# Altium project PCB_Project.PrjPcb
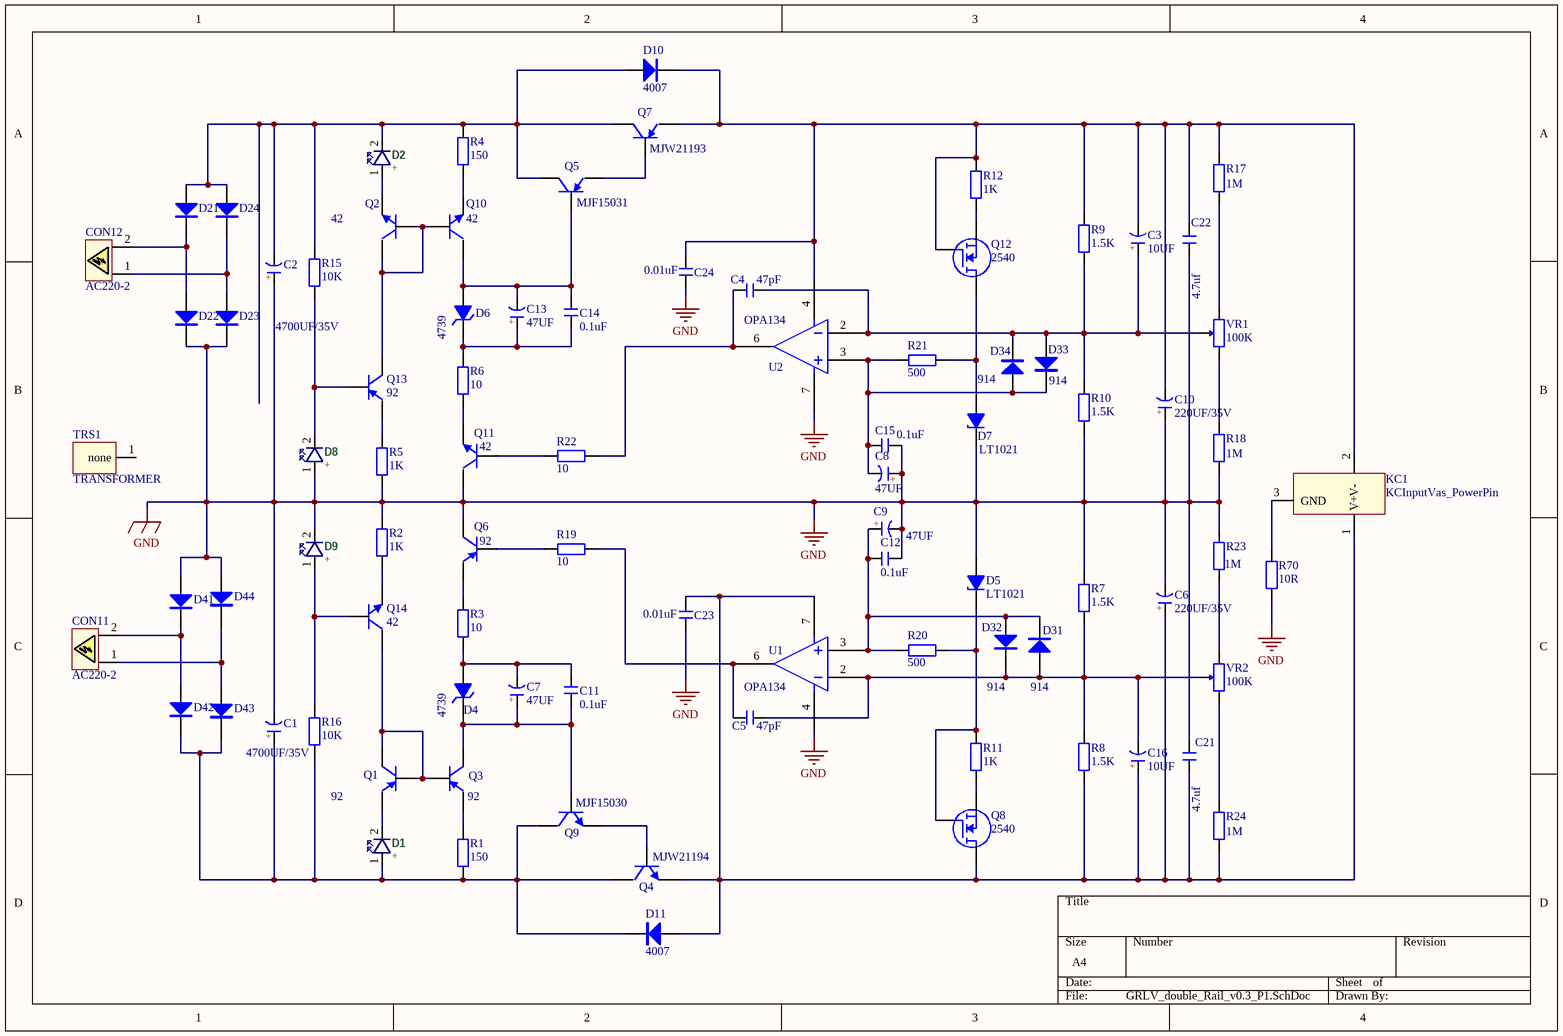
[diagram p0: GRLV_double_Rail_v0.3_P1.SchDoc]
2 sheets, 173 parts. Net scope: global (net labels, ports and power ports of the same name join across sheets).
Board file: GRLV_double_Rail_v0.3.PcbDoc
Sheets:
  GRLV_double_Rail_v0.3_P1.SchDoc
  GRLV_double_Rail_v0.3_P2.SchDoc

## Sheet GRLV_double_Rail_v0.3_P1.SchDoc
size A4

### Parts
C1  4700UF/35V  [CAP 10*22*31.5 - BK]
C2  4700UF/35V  [CAP 10*22*31.5 - BK]
C3  10UF  [CAP 2.5*6.3*7]
C4  47pF  [CBB 6.3*6.3*5]
C5  47pF  [CBB 6.3*6.3*5]
C6  220UF/35V  [CAP 5.0*10*12.5]
C7  47UF  [CAP 3.5*8*11.5]
C8  47UF  [CAP 2.5*6.3*11.2]
C9  47UF  [CAP 2.5*6.3*11.2]
C10  220UF/35V  [CAP 5.0*10*12.5]
C11  0.1uF  [CBB 6.3*6.3*5]
C12  0.1uF  [CBB 6.3*6.3*5]
C13  47UF  [CAP 3.5*8*11.5]
C14  0.1uF  [CBB 6.3*6.3*5]
C15  0.1uF  [CBB 6.3*6.3*5]
C16  10UF  [CAP 2.5*6.3*7]
C21  4.7uf  [CBB 7.2*7.2*13]
C22  4.7uf  [CBB 7.2*7.2*13]
C23  value 0.01uF  [CBB 6.3*6.3*5]  (hidden comment: .01)
C24  value 0.01uF  [CBB 6.3*6.3*5]  (hidden comment: .01)
CON11  AC220-2  [HX4.0-2XS]
CON12  AC220-2  [HX4.0-2XS]
D1  +  [LED 3MM-R]
D2  +  [LED 3MM-R]
D4  4739  [DO-41]
D5  LT1021  [DIP8-300_MH]
D6  4739  [DO-41]
D7  LT1021  [DIP8-300_MH]
D8  +  [LED 3MM-R]
D9  +  [LED 3MM-R]
D10  4007  [DO-41]
D11  4007  [DO-41]
D21  VS-HFA08TB60-M3  [DO-15XL]  (value not drawn)
D22  VS-HFA08TB60-M3  [DO-15XL]  (value not drawn)
D23  VS-HFA08TB60-M3  [DO-15XL]  (value not drawn)
D24  VS-HFA08TB60-M3  [DO-15XL]  (value not drawn)
D31  914  [DO-35]
D32  914  [DO-35]
D33  914  [DO-35]
D34  914  [DO-35]
D41  VS-HFA08TB60-M3  [DO-15XL]  (value not drawn)
D42  VS-HFA08TB60-M3  [DO-15XL]  (value not drawn)
D43  VS-HFA08TB60-M3  [DO-15XL]  (value not drawn)
D44  VS-HFA08TB60-M3  [DO-15XL]  (value not drawn)
KC1  KCInputVas_PowerPin  [KCIn_VAS_PowerPin_M2.0]
Q1  92  [TO92A]
Q2  42  [TO92A]
Q3  92  [TO92A]
Q4  MJW21194  [TO247V]
Q5  MJF15031  [TO220V]
Q6  92  [TO92A]
Q7  MJW21193  [TO247V]
Q8  2540  [TO92A]
Q9  MJF15030  [TO220V]
Q10  42  [TO92A]
Q11  42  [TO92A]
Q12  2540  [TO92A]
Q13  92  [TO92A]
Q14  42  [TO92A]
R1  150  [RS 1/4W]
R2  1K  [RS 1/4W]
R3  10  [RS 1/4W]
R4  150  [RS 1/4W]
R5  1K  [RS 1/4W]
R6  10  [RS 1/4W]
R7  1.5K  [RS 1/4W]
R8  1.5K  [RS 1/4W]
R9  1.5K  [RS 1/4W]
R10  1.5K  [RS 1/4W]
R11  1K  [RS 1/4W]
R12  1K  [RS 1/4W]
R15  10K  [RS 1/4W]
R16  10K  [RS 1/4W]
R17  1M  [RS 1/4W]
R18  1M  [RS 1/4W]
R19  10  [RS 1/4W]
R20  500  [RS 1/4W]
R21  500  [RS 1/4W]
R22  10  [RS 1/4W]
R23  1M  [RS 1/4W]
R24  1M  [RS 1/4W]
R70  10R  [RS 1/2W]
TRS1  TRANSFORMER  [TRANS_BLOCK_m4_68mm]
U1  OPA134  [DIP8-300_MH]
U2  OPA134  [DIP8-300_MH]
VR1  100K  [RS 1/2W-VR]
VR2  100K  [RS 1/2W-VR]

### Nets
GND: C1.2(K) C2.1(A) C6.2(K) C8.1(A) C9.2(K) C10.1(A) C12.2 C15.2 C21.2 C22.1 C23.1 C24.1 D5.4(A) D7.6(K) D8.1(A) D9.2(K) D22.1(Cathode) D23.1(Cathode) D41.2(Anode) D44.2(Anode) Q6.3(C) Q11.3(C) R2.2 R5.1 R7.2 R10.1 R18.1 R23.2 R70.1 U1.4(V-) U2.7(V+)
NetC1_1: C1.1(A) D1.1(A) D11.2(K) D42.1(Cathode) D43.1(Cathode) Q4.2(C) Q9.2(C) R1.1 R16.1
NetC2_2: C2.2(K) D2.2(K) D10.1(A) D21.2(Anode) D24.2(Anode) Q5.2(C) Q7.2(C) R4.2 R15.2
NetC3_1: C3.1(A) C4.2 D33.1(A) D34.2(K) R9.1 R10.2 U2.2(-in) VR1.3
NetC3_2: C3.2(K) C10.2(K) C22.2 C24.2 D10.2(K) KC1.2(V-) Q7.3(E) Q12.2(G) R9.2 R12.2 R17.2 U2.4(V-)
NetC4_1: C4.1 R22.2 U2.6(out)
NetC5_1: C5.1 R19.2 U1.6(out)
NetC5_2: C5.2 C16.2(K) D31.1(A) D32.2(K) R7.1 R8.2 U1.2(-in) VR2.3
NetC6_1: C6.1(A) C16.1(A) C21.1 C23.2 D11.1(A) KC1.1(V+) Q4.3(E) Q8.3(D) R8.1 R24.1 U1.7(V+)
NetC7_1: C7.1(A) C11.1 D4.2(K) Q3.3(C) Q9.1(B)
NetC7_2: C7.2(K) C11.2 D4.1(A) R3.1
NetC8_2: C8.2(K) C15.1 D33.2(K) D34.1(A) R21.1 U2.3(+in)
NetC9_1: C9.1(A) C12.1 D31.2(K) D32.1(A) R20.1 U1.3(+in)
NetC13_1: C13.1(A) C14.1 D6.2(K) R6.2
NetC13_2: C13.2(K) C14.2 D6.1(A) Q5.1(B) Q10.3(C)
NetCON11_1: CON11.1(L) D43.2(Anode) D44.1(Cathode)
NetCON11_2: CON11.2(G) D41.1(Cathode) D42.2(Anode)
NetCON12_1: CON12.1(L) D23.2(Anode) D24.1(Cathode)
NetCON12_2: CON12.2(G) D21.1(Cathode) D22.2(Anode)
NetD1_2: D1.2(K) Q1.1(E)
NetD2_1: D2.1(A) Q2.1(E)
NetD5_6: D5.6(K) Q8.2(G) R11.2 R20.2
NetD7_4: D7.4(A) Q12.3(D) R21.2
NetD8_2: D8.2(K) Q13.2(B) R15.1
NetD9_1: D9.1(A) Q14.2(B) R16.2
NetKC1_3: KC1.3(GND) R70.2
NetQ1_2: Q1.2(B) Q1.3(C) Q3.2(B) Q14.3(C)
NetQ2_2: Q2.2(B) Q2.3(C) Q10.2(B) Q13.3(C)
NetQ3_1: Q3.1(E) R1.2
NetQ4_1: Q4.1(B) Q9.3(E)
NetQ5_3: Q5.3(E) Q7.1(B)
NetQ6_1: Q6.1(E) R3.2
NetQ6_2: Q6.2(B) R19.1
NetQ8_1: Q8.1(S) R11.1
NetQ10_1: Q10.1(E) R4.1
NetQ11_1: Q11.1(E) R6.1
NetQ11_2: Q11.2(B) R22.1
NetQ12_1: Q12.1(S) R12.1
NetQ13_1: Q13.1(E) R5.2
NetQ14_1: Q14.1(E) R2.1
NetR17_1: R17.1 VR1.2
NetR18_2: R18.2 VR1.1
NetR23_1: R23.1 VR2.2
NetR24_2: R24.2 VR2.1

Not connected (* = marked no-connect by the designer): TRS1 1(none)

### Notes on the sheet
- (in symbol C-CAP) +

### Library data of the parts
C1-C3 C6-C10 C13 C16 = C-CAP: 直插电解电容; 版权归属: 源创客; BOM名称: 直插电解电容; 学习资源: www.ooocke.com
C4 C5 C11 C12 C14 C15 C23 C24 = C-CBB: CBB电容; 版权归属: 源创客; BOM名称: CBB电容; 学习资源: www.ooocke.com
C21 C22 = C-MKS: MKS薄膜电容
D1 D2 D8 D9 = LED: 直插式LED
D4 D6 = 1N4739: 9.1V/1W稳压管
D5 D7 = LT1021-10-2P: 10V Precision Reference 2 Pin Config
D10 D11 = 1N4007: 整流二极管; 版权归属: 源创客; BOM名称: 整流二极管; 学习资源: www.ooocke.com
D21-D24 D41-D44 = VS-HFA08TB60-M3: Ultrafast Soft Recovery Diado 8A 600V; pin to pad: 1>2 2>1
D31-D34 = 1N914: 高速开关管 1V/0.25W
KC1 = KCInputVas_PowerPin: King Cello Input Stage and VAS
Q1 Q3 Q6 Q13 = KSP92/93: High Voltage PNP Transistor
Q2 Q10 Q11 Q14 = KSP42/43: High Voltage NPN Transistor
Q4 = MJW21194: Power NPN Transistor
Q5 = MJF15031: Power PNP Transistor
Q7 = MJW21193: Power PNP Transistor
Q8 Q12 = DN2540: N沟道耗尽型DMOS场效应管 400V/150ma
Q9 = MJF15030: Power NPN Transistor
R1-R12 R15-R24 R70 = R-CRR: 直插色环电阻; BOM名称: 色环电阻; 版权归属: 源创客; 学习资源: www.ooocke.com
  R4: Value: 150
  R9: Value: 1.5K
  R17 R18 R23 R24: Value: 1M
U1 U2 = OPA134PA
VR1 VR2 = VR-W: 直插可调电阻-顶调

## Sheet GRLV_double_Rail_v0.3_P2.SchDoc
size A4
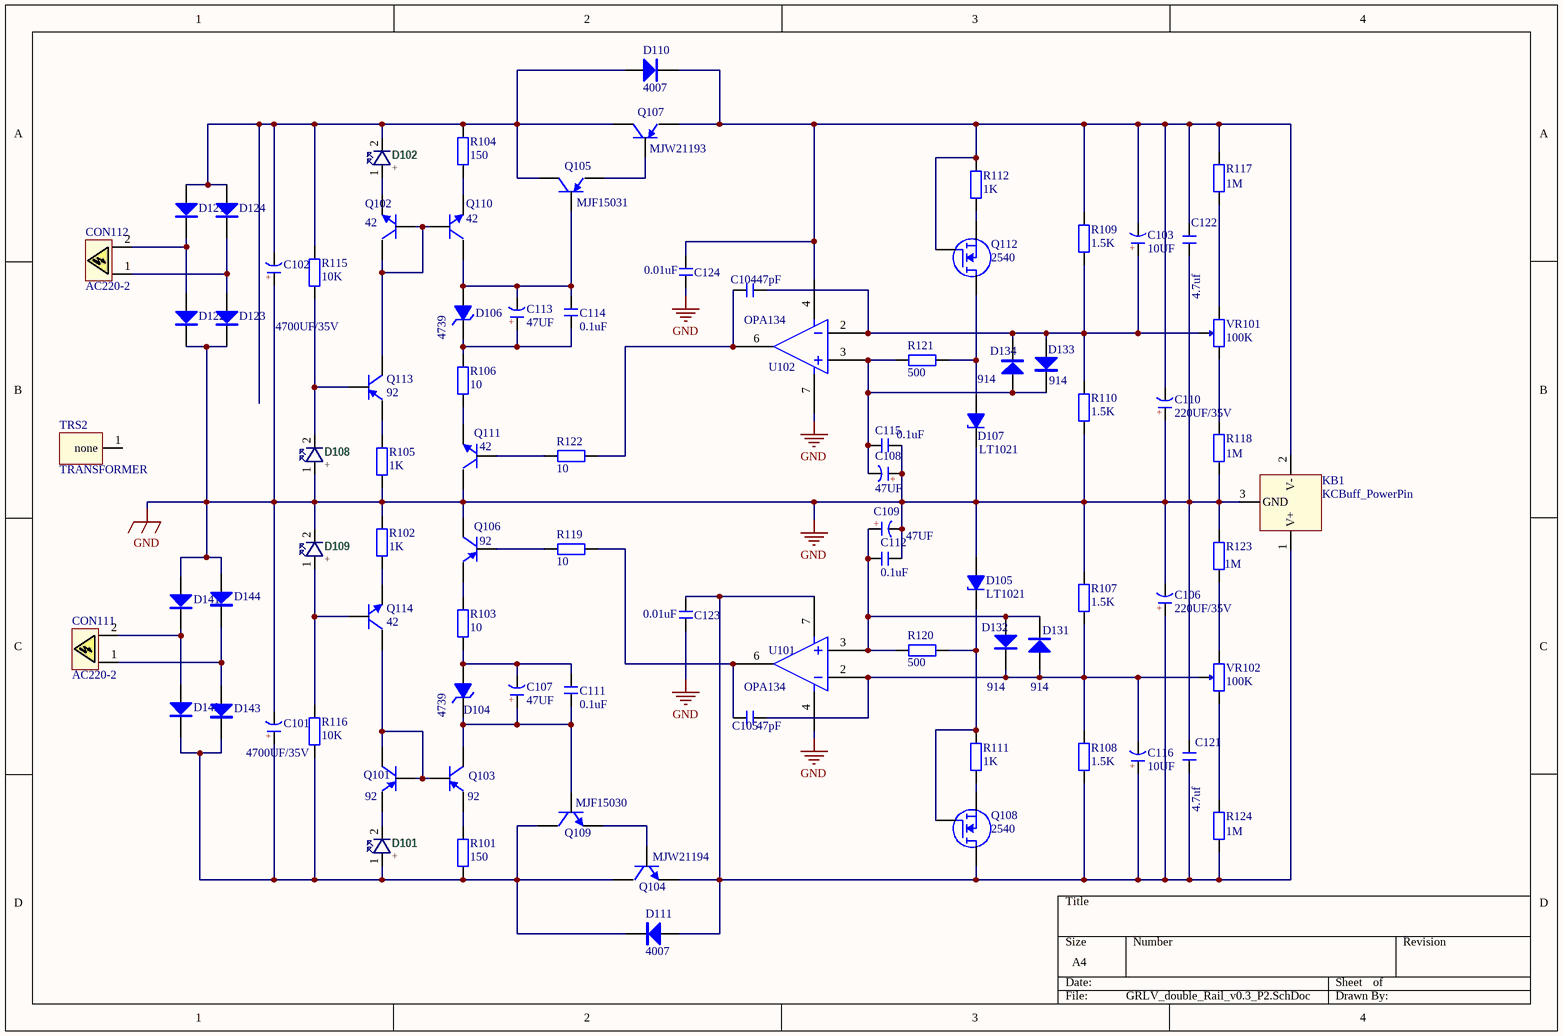
[diagram p1: GRLV_double_Rail_v0.3_P2.SchDoc]

### Parts
C101  4700UF/35V  [CAP 10*22*31.5 - BK]
C102  4700UF/35V  [CAP 10*22*31.5 - BK]
C103  10UF  [CAP 2.5*6.3*7]
C104  47pF  [CBB 6.3*6.3*5]
C105  47pF  [CBB 6.3*6.3*5]
C106  220UF/35V  [CAP 5.0*10*12.5]
C107  47UF  [CAP 3.5*8*11.5]
C108  47UF  [CAP 2.5*6.3*11.2]
C109  47UF  [CAP 2.5*6.3*11.2]
C110  220UF/35V  [CAP 5.0*10*12.5]
C111  0.1uF  [CBB 6.3*6.3*5]
C112  0.1uF  [CBB 6.3*6.3*5]
C113  47UF  [CAP 3.5*8*11.5]
C114  0.1uF  [CBB 6.3*6.3*5]
C115  0.1uF  [CBB 6.3*6.3*5]
C116  10UF  [CAP 2.5*6.3*7]
C121  4.7uf  [CBB 7.2*7.2*13]
C122  4.7uf  [CBB 7.2*7.2*13]
C123  value 0.01uF  [CBB 6.3*6.3*5]  (hidden comment: .01)
C124  value 0.01uF  [CBB 6.3*6.3*5]  (hidden comment: .01)
CON111  AC220-2  [HX4.0-2XS]
CON112  AC220-2  [HX4.0-2XS]
D101  +  [LED 3MM-R]
D102  +  [LED 3MM-R]
D104  4739  [DO-41]
D105  LT1021  [DIP8-300_MH]
D106  4739  [DO-41]
D107  LT1021  [DIP8-300_MH]
D108  +  [LED 3MM-R]
D109  +  [LED 3MM-R]
D110  4007  [DO-41]
D111  4007  [DO-41]
D121  VS-HFA08TB60-M3  [DO-15XL]  (value not drawn)
D122  VS-HFA08TB60-M3  [DO-15XL]  (value not drawn)
D123  VS-HFA08TB60-M3  [DO-15XL]  (value not drawn)
D124  VS-HFA08TB60-M3  [DO-15XL]  (value not drawn)
D131  914  [DO-35]
D132  914  [DO-35]
D133  914  [DO-35]
D134  914  [DO-35]
D141  VS-HFA08TB60-M3  [DO-15XL]  (value not drawn)
D142  VS-HFA08TB60-M3  [DO-15XL]  (value not drawn)
D143  VS-HFA08TB60-M3  [DO-15XL]  (value not drawn)
D144  VS-HFA08TB60-M3  [DO-15XL]  (value not drawn)
KB1  KCBuff_PowerPin  [KCBuff_PowerPin_M2.0]
Q101  92  [TO92A]
Q102  42  [TO92A]
Q103  92  [TO92A]
Q104  MJW21194  [TO247V]
Q105  MJF15031  [TO220V]
Q106  92  [TO92A]
Q107  MJW21193  [TO247V]
Q108  2540  [TO92A]
Q109  MJF15030  [TO220V]
Q110  42  [TO92A]
Q111  42  [TO92A]
Q112  2540  [TO92A]
Q113  92  [TO92A]
Q114  42  [TO92A]
R101  150  [RS 1/4W]
R102  1K  [RS 1/4W]
R103  10  [RS 1/4W]
R104  150  [RS 1/4W]
R105  1K  [RS 1/4W]
R106  10  [RS 1/4W]
R107  1.5K  [RS 1/4W]
R108  1.5K  [RS 1/4W]
R109  1.5K  [RS 1/4W]
R110  1.5K  [RS 1/4W]
R111  1K  [RS 1/4W]
R112  1K  [RS 1/4W]
R115  10K  [RS 1/4W]
R116  10K  [RS 1/4W]
R117  1M  [RS 1/4W]
R118  1M  [RS 1/4W]
R119  10  [RS 1/4W]
R120  500  [RS 1/4W]
R121  500  [RS 1/4W]
R122  10  [RS 1/4W]
R123  1M  [RS 1/4W]
R124  1M  [RS 1/4W]
TRS2  TRANSFORMER  [TRANS_BLOCK_m4_68mm]
U101  OPA134  [DIP8-300_MH]
U102  OPA134  [DIP8-300_MH]
VR101  100K  [RS 1/2W-VR]
VR102  100K  [RS 1/2W-VR]

### Nets
GND: C101.2(K) C102.1(A) C106.2(K) C108.1(A) C109.2(K) C110.1(A) C112.2 C115.2 C121.2 C122.1 C123.1 C124.1 D105.4(A) D107.6(K) D108.1(A) D109.2(K) D122.1(Cathode) D123.1(Cathode) D141.2(Anode) D144.2(Anode) KB1.3(GND) Q106.3(C) Q111.3(C) R102.2 R105.1 R107.2 R110.1 R118.1 R123.2 U101.4(V-) U102.7(V+)
NetC101_1: C101.1(A) D101.1(A) D111.2(K) D142.1(Cathode) D143.1(Cathode) Q104.2(C) Q109.2(C) R101.1 R116.1
NetC102_2: C102.2(K) D102.2(K) D110.1(A) D121.2(Anode) D124.2(Anode) Q105.2(C) Q107.2(C) R104.2 R115.2
NetC103_1: C103.1(A) C104.2 D133.1(A) D134.2(K) R109.1 R110.2 U102.2(-in) VR101.3
NetC103_2: C103.2(K) C110.2(K) C122.2 C124.2 D110.2(K) KB1.2(V-) Q107.3(E) Q112.2(G) R109.2 R112.2 R117.2 U102.4(V-)
NetC104_1: C104.1 R122.2 U102.6(out)
NetC105_1: C105.1 R119.2 U101.6(out)
NetC105_2: C105.2 C116.2(K) D131.1(A) D132.2(K) R107.1 R108.2 U101.2(-in) VR102.3
NetC106_1: C106.1(A) C116.1(A) C121.1 C123.2 D111.1(A) KB1.1(V+) Q104.3(E) Q108.3(D) R108.1 R124.1 U101.7(V+)
NetC107_1: C107.1(A) C111.1 D104.2(K) Q103.3(C) Q109.1(B)
NetC107_2: C107.2(K) C111.2 D104.1(A) R103.1
NetC108_2: C108.2(K) C115.1 D133.2(K) D134.1(A) R121.1 U102.3(+in)
NetC109_1: C109.1(A) C112.1 D131.2(K) D132.1(A) R120.1 U101.3(+in)
NetC113_1: C113.1(A) C114.1 D106.2(K) R106.2
NetC113_2: C113.2(K) C114.2 D106.1(A) Q105.1(B) Q110.3(C)
NetCON111_1: CON111.1(L) D143.2(Anode) D144.1(Cathode)
NetCON111_2: CON111.2(G) D141.1(Cathode) D142.2(Anode)
NetCON112_1: CON112.1(L) D123.2(Anode) D124.1(Cathode)
NetCON112_2: CON112.2(G) D121.1(Cathode) D122.2(Anode)
NetD101_2: D101.2(K) Q101.1(E)
NetD102_1: D102.1(A) Q102.1(E)
NetD105_6: D105.6(K) Q108.2(G) R111.2 R120.2
NetD107_4: D107.4(A) Q112.3(D) R121.2
NetD108_2: D108.2(K) Q113.2(B) R115.1
NetD109_1: D109.1(A) Q114.2(B) R116.2
NetQ101_2: Q101.2(B) Q101.3(C) Q103.2(B) Q114.3(C)
NetQ102_2: Q102.2(B) Q102.3(C) Q110.2(B) Q113.3(C)
NetQ103_1: Q103.1(E) R101.2
NetQ104_1: Q104.1(B) Q109.3(E)
NetQ105_3: Q105.3(E) Q107.1(B)
NetQ106_1: Q106.1(E) R103.2
NetQ106_2: Q106.2(B) R119.1
NetQ108_1: Q108.1(S) R111.1
NetQ110_1: Q110.1(E) R104.1
NetQ111_1: Q111.1(E) R106.1
NetQ111_2: Q111.2(B) R122.1
NetQ112_1: Q112.1(S) R112.1
NetQ113_1: Q113.1(E) R105.2
NetQ114_1: Q114.1(E) R102.1
NetR117_1: R117.1 VR101.2
NetR118_2: R118.2 VR101.1
NetR123_1: R123.1 VR102.2
NetR124_2: R124.2 VR102.1

Not connected (* = marked no-connect by the designer): TRS2 1(none)

### Notes on the sheet
- (in symbol C-CAP) +

### Library data of the parts
C101-C103 C106-C110 C113 C116 = C-CAP: 直插电解电容; 版权归属: 源创客; BOM名称: 直插电解电容; 学习资源: www.ooocke.com
C104 C105 C111 C112 C114 C115 C123 C124 = C-CBB: CBB电容; 版权归属: 源创客; BOM名称: CBB电容; 学习资源: www.ooocke.com
C121 C122 = C-MKS: MKS薄膜电容
D101 D102 D108 D109 = LED: 直插式LED
D104 D106 = 1N4739: 9.1V/1W稳压管
D105 D107 = LT1021-10-2P: 10V Precision Reference 2 Pin Config
D110 D111 = 1N4007: 整流二极管; 版权归属: 源创客; BOM名称: 整流二极管; 学习资源: www.ooocke.com
D121-D124 D141-D144 = VS-HFA08TB60-M3: Ultrafast Soft Recovery Diado 8A 600V; pin to pad: 1>2 2>1
D131-D134 = 1N914: 高速开关管 1V/0.25W
KB1 = KCBuff_PowerPin: King Cello Buffer Stage
Q101 Q103 Q106 Q113 = KSP92/93: High Voltage PNP Transistor
Q102 Q110 Q111 Q114 = KSP42/43: High Voltage NPN Transistor
Q104 = MJW21194: Power NPN Transistor
Q105 = MJF15031: Power PNP Transistor
Q107 = MJW21193: Power PNP Transistor
Q108 Q112 = DN2540: N沟道耗尽型DMOS场效应管 400V/150ma
Q109 = MJF15030: Power NPN Transistor
R101-R112 R115-R124 = R-CRR: 直插色环电阻; BOM名称: 色环电阻; 版权归属: 源创客; 学习资源: www.ooocke.com
  R104: Value: 150
  R109: Value: 1.5K
  R117 R118 R123 R124: Value: 1M
U101 U102 = OPA134PA
VR101 VR102 = VR-W: 直插可调电阻-顶调

## Nets that join several sheets
GND: GRLV_double_Rail_v0.3_P1 (31 pins), GRLV_double_Rail_v0.3_P2 (31 pins)